# EAGLE board system-controller (EAGLE 7.6.0)
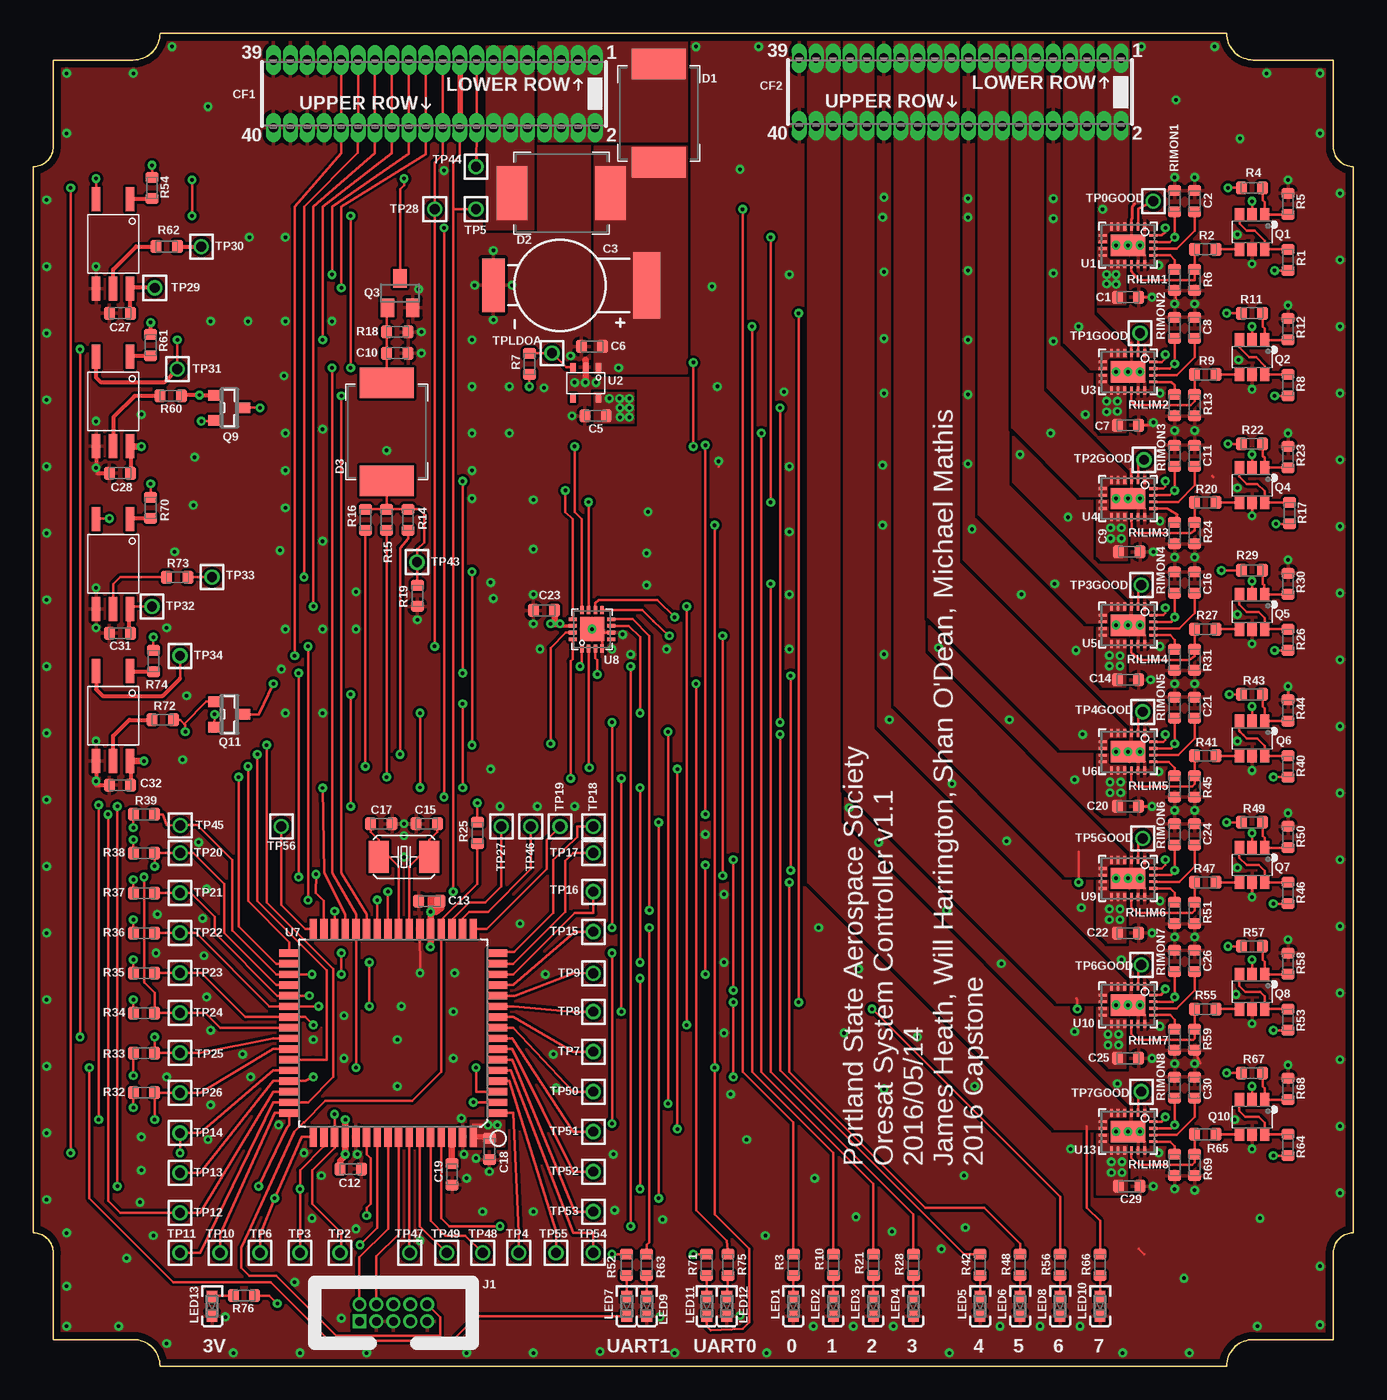
[diagram p2: board, top side]
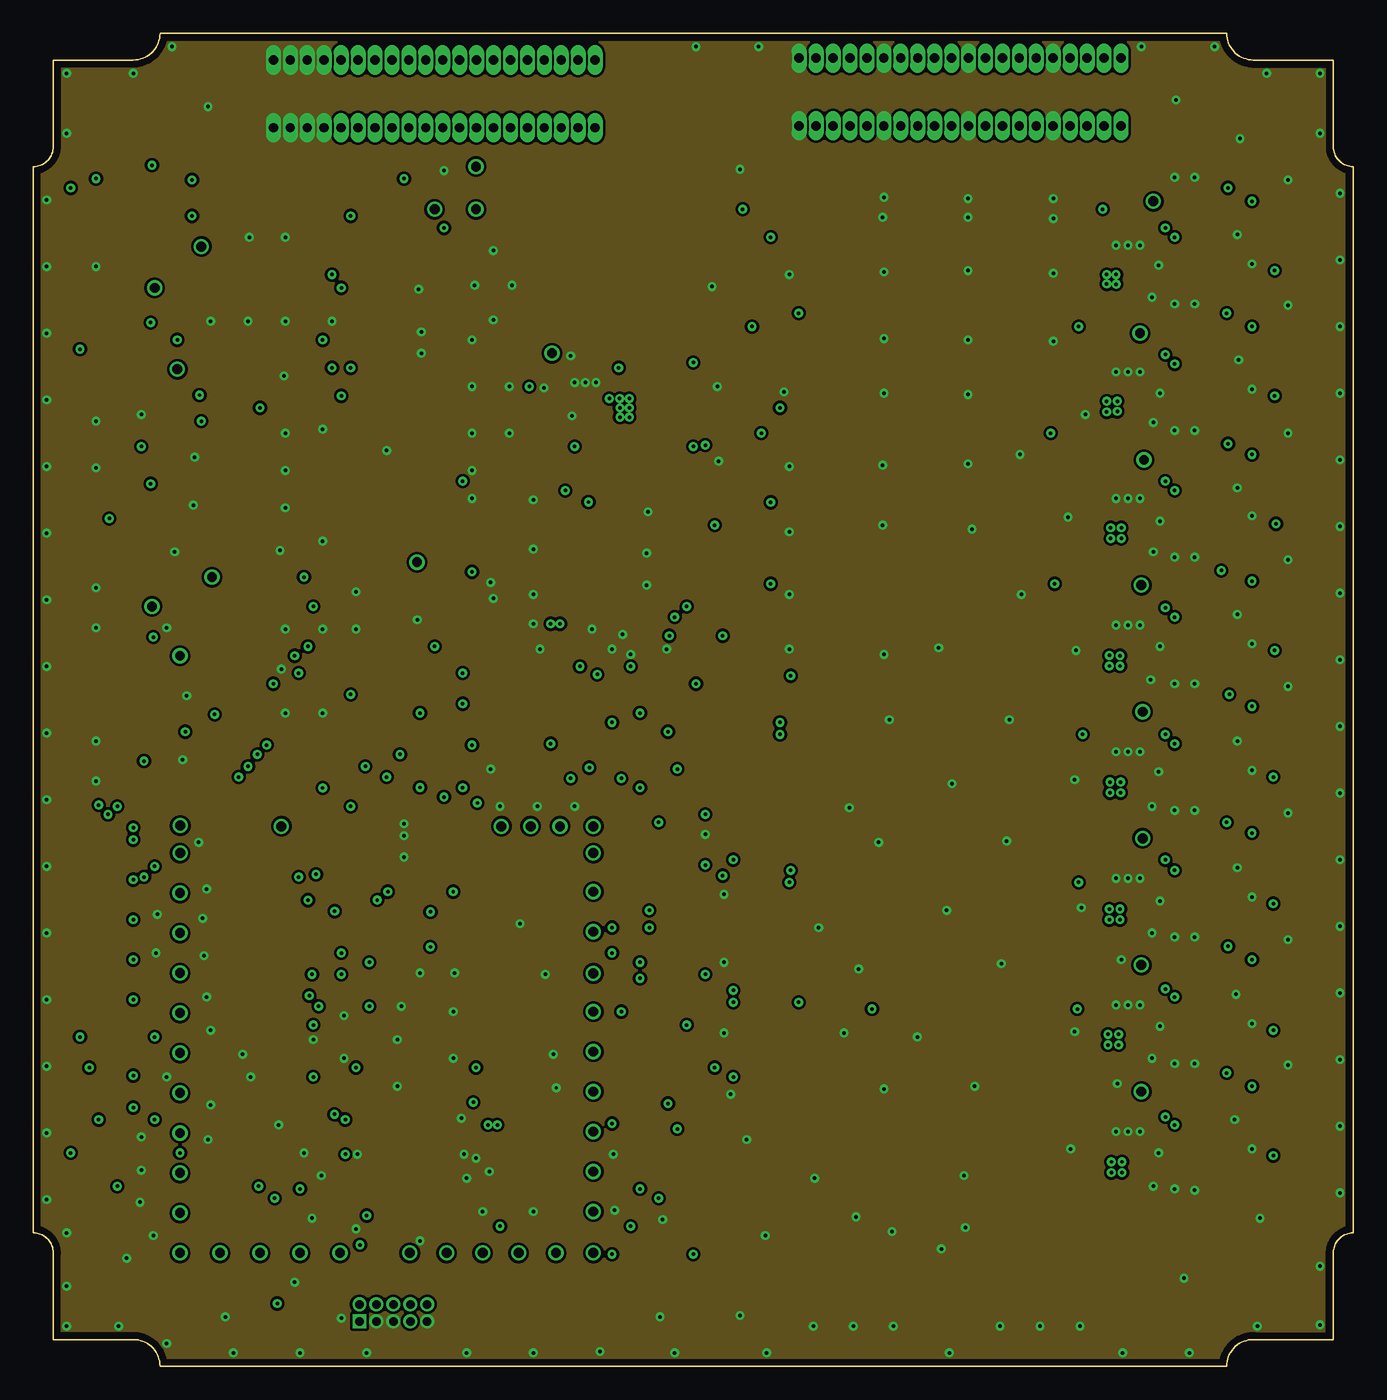
[diagram p3: board, inner layer Route2]
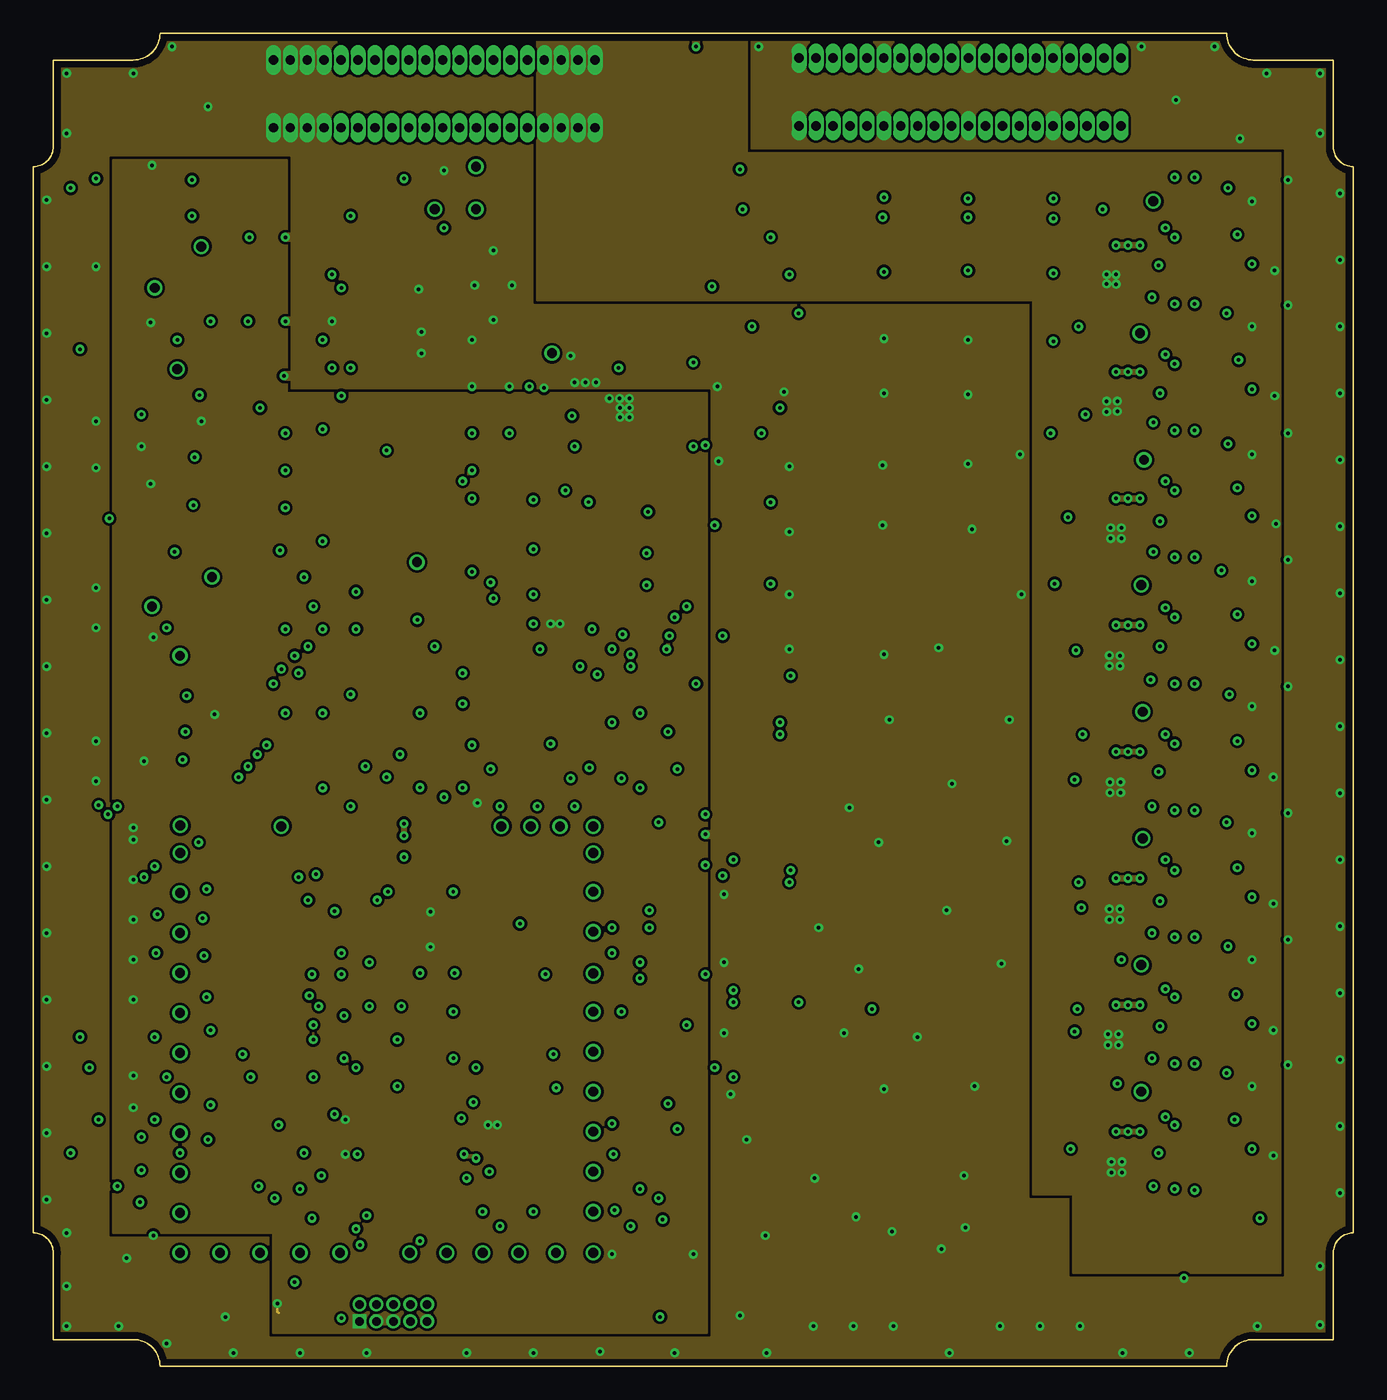
[diagram p4: board, inner layer Route15]
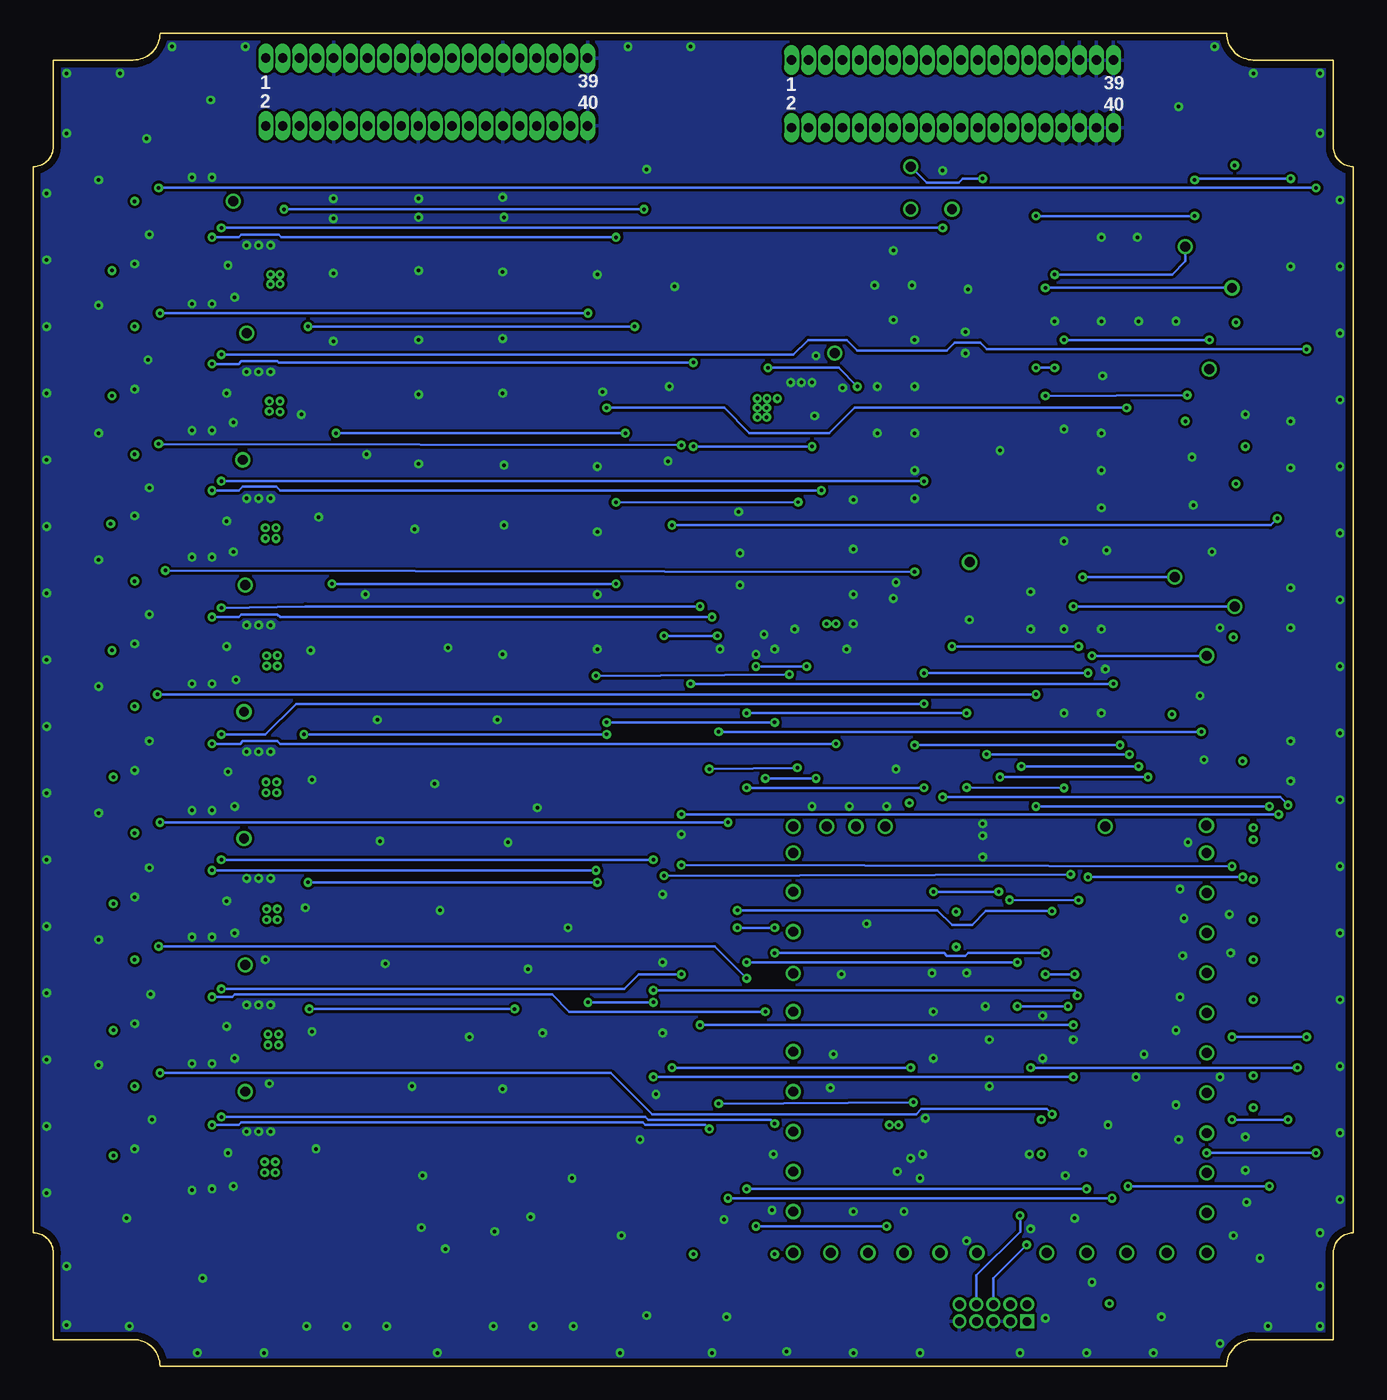
[diagram p5: board, bottom side, seen from below]

Size 99 x 100 mm. Coordinates in mm from the lower left corner, seen from the top.
Copper layers (1+2*15+16): Top 0.0178mm / dielectric 12mil / Route2 0.0356mm / dielectric 28mil / Route15 0.0356mm / dielectric 12mil / Bottom 0.0178mm
Design rules "psas-4Lyr_v1.0.0.3": minimum track width 6mil, minimum drill 10mil, track to track 6mil, track to pad 6mil, pad to pad 6mil, via to via 6mil, smd to smd 6mil, copper to edge 20mil, drill to drill 16mil, minimum pad ring 8mil, minimum via ring 8mil, stop-mask expansion 3mil, vias tented up to drill 11mil, thermal gap 10mil
tRestrict: 8 lines

## Footprints (pad centres in the part's own frame; a part is rotated, then mirrored left to right if it is on the bottom)
.0603-B-NOSILK = smd 0.8 x 0.95: 1 -0.8,0; 2 0.8,0
CAP-ELNA-DS-SERIES = smd 5 x 2: + 0,6.5 | smd 4 x 1.7: - 0,-5
HARWIN-ARCHER-M50-3202045 = drill 0.7 pad 1.07 long: P$1 -12.065,-2.54; P$2 -12.065,2.54; P$3 -10.795,-2.54; P$4 -10.795,2.54; P$5 -9.525,-2.54; P$6 -9.525,2.54; P$7 -8.255,-2.54; P$8 -8.255,2.54; P$9 -6.985,-2.54; P$10 -6.985,2.54; P$11 -5.715,-2.54; P$12 -5.715,2.54; P$13 -4.445,-2.54; P$14 -4.445,2.54; P$15 -3.175,-2.54; P$16 -3.175,2.54; P$17 -1.905,-2.54; P$18 -1.905,2.54; P$19 -0.635,-2.54; P$20 -0.635,2.54; P$21 0.635,-2.54; P$22 0.635,2.54; P$23 1.905,-2.54; P$24 1.905,2.54; P$25 3.175,-2.54; P$26 3.175,2.54; P$27 4.445,-2.54; P$28 4.445,2.54; P$29 5.715,-2.54; P$30 5.715,2.54; P$31 6.985,-2.54; P$32 6.985,2.54; P$33 8.255,-2.54; P$34 8.255,2.54; P$35 9.525,-2.54; P$36 9.525,2.54; P$37 10.795,-2.54; P$38 10.795,2.54; P$39 12.065,-2.54; P$40 12.065,2.54
DO-214AB = smd 2.286 x 4.064: 1 -3.683,0; 2 3.683,0
PINHEADER-2X5-0.05+POL+SILK = drill 0.635 pad 1.04 square: 1 -2.54,-0.635 | drill 0.635 pad 1.04: 2 -2.54,0.635; 3 -1.27,-0.635; 4 -1.27,0.635; 5 0,-0.635; 6 0,0.635; 7 1.27,-0.635; 8 1.27,0.635; 9 2.54,-0.635; 10 2.54,0.635
LED-0603 = smd 0.8 x 0.8: A 0.75,0; K -0.75,0
SOT23-6 = smd 0.7 x 1: 1 0.95,1.3; 2 0,1.3; 3 -0.95,1.3; 4 -0.95,-1.3; 5 0,-1.3; 6 0.95,-1.3
SOT23 = smd 1 x 1.4: 1 -0.95,-1.1; 2 0.95,-1.1; 3 0,1.1
SOT23' = smd 0.787 x 0.889: 1 -0.953,-1.143; 2 0.953,-1.143; 3 0,1.143
2MM-TEST-POINT = drill 0.737: 1 0,0
QFN-20-L = smd 0.2 x 0.6: 1 -1.252,-1.395; 2 -0.752,-1.395; 3 -0.252,-1.395; 4 0.248,-1.395; 5 0.748,-1.395; 6 1.248,-1.395; 11 1.248,1.405; 12 0.748,1.405; 13 0.248,1.405; 14 -0.252,1.405; 15 -0.752,1.405; 16 -1.252,1.405 | smd 0.6 x 0.2: 7 1.905,-0.748; 8 1.905,-0.248; 9 1.905,0.252; 10 1.905,0.752; 17 -1.908,0.755; 18 -1.91,0.25; 19 -1.905,-0.248; 20 -1.905,-0.748 | smd 2.6 x 1.6: 21 0,0
SOT-23 = smd 0.4 x 0.625: 1 0.978,1.142; 2 0.028,1.142; 3 -0.922,1.142; 4 -0.922,-1.188; 5 0.978,-1.188
TQFP64 = smd 1.5 x 0.55: 1 -7.8,6; 2 -7.8,5.2; 3 -7.8,4.4; 4 -7.8,3.6; 5 -7.8,2.8; 6 -7.8,2; 7 -7.8,1.2; 8 -7.8,0.4; 9 -7.8,-0.4; 10 -7.8,-1.2; 11 -7.8,-2; 12 -7.8,-2.8; 13 -7.8,-3.6; 14 -7.8,-4.4; 15 -7.8,-5.2; 16 -7.8,-6; 33 7.8,-6; 34 7.8,-5.2; 35 7.8,-4.4; 36 7.8,-3.6; 37 7.8,-2.8; 38 7.8,-2; 39 7.8,-1.2; 40 7.8,-0.4; 41 7.8,0.4; 42 7.8,1.2; 43 7.8,2; 44 7.8,2.8; 45 7.8,3.6; 46 7.8,4.4; 47 7.8,5.2; 48 7.8,6 | smd 0.55 x 1.5: 17 -6,-7.8; 18 -5.2,-7.8; 19 -4.4,-7.8; 20 -3.6,-7.8; 21 -2.8,-7.8; 22 -2,-7.8; 23 -1.2,-7.8; 24 -0.4,-7.8; 25 0.4,-7.8; 26 1.2,-7.8; 27 2,-7.8; 28 2.8,-7.8; 29 3.6,-7.8; 30 4.4,-7.8; 31 5.2,-7.8; 32 6,-7.8; 49 6,7.8; 50 5.2,7.8; 51 4.4,7.8; 52 3.6,7.8; 53 2.8,7.8; 54 2,7.8; 55 1.2,7.8; 56 0.4,7.8; 57 -0.4,7.8; 58 -1.2,7.8; 59 -2,7.8; 60 -2.8,7.8; 61 -3.6,7.8; 62 -4.4,7.8; 63 -5.2,7.8; 64 -6,7.8
QFN50P400X400X80-17N = smd 0.6 x 0.28: 1 -1.444,0.752; 2 -1.444,0.254; 3 -1.444,-0.254; 4 -1.444,-0.752; 9 1.456,-0.752; 10 1.456,-0.254; 11 1.456,0.254; 12 1.456,0.752 | smd 0.28 x 0.6: 5 -0.752,-1.444; 6 -0.254,-1.444; 7 0.254,-1.444; 8 0.752,-1.444; 13 0.752,1.456; 14 0.254,1.456; 15 -0.254,1.456; 16 -0.752,1.456 | smd 1.8 x 1.8: 17 0,0
ACPL-M61L = smd 0.64 x 1.8: 1 -1.255,-3.655; 2 1.285,-3.655; 3 1.285,3.075; 4 0.015,3.075; 5 -1.255,3.075
CRYSTAL-ABRACON-ABM3-SMD = smd 1.5 x 2.4: P$1 -1.9,0; P$2 1.9,0

## Placement (x,y rotation side)
C1  1uF  [.0603-B-NOSILK]  82.1,80.2 180 top
C2  2.2nF  [.0603-B-NOSILK]  87.1,87.4 90 top
C3  CAP-ELNA-DS  [CAP-ELNA-DS-SERIES]  39.5,81.1 270 top
C5  2.2uF  [.0603-B-NOSILK]  42.17,71.3 180 top
C6  1uF  [.0603-B-NOSILK]  41.9,76.5 0 top
C7  1uF  [.0603-B-NOSILK]  82.1,70.6 180 top
C8  2.2nF  [.0603-B-NOSILK]  87.1,77.9 90 top
C9  1uF  [.0603-B-NOSILK]  82.2,61.1 180 top
C10  22u  [.0603-B-NOSILK]  27.3,76 0 top
C11  2.2nF  [.0603-B-NOSILK]  87.1,68.3 90 top
C12  100nF  [.0603-B-NOSILK]  23.8,14.8 180 top
C13  100nF  [.0603-B-NOSILK]  29.7,34.9 0 top
C14  1uF  [.0603-B-NOSILK]  82.1,51.5 180 top
C15  9pF  [.0603-B-NOSILK]  29.5,40.7 0 top
C16  2.2nF  [.0603-B-NOSILK]  87.1,58.8 90 top
C17  9pF  [.0603-B-NOSILK]  26.1,40.7 180 top
C18  100nF  [.0603-B-NOSILK]  34.2,16.3 90 top
C19  100nF  [.0603-B-NOSILK]  31.4,14.4 90 top
C20  1uF  [.0603-B-NOSILK]  82.1,42 180 top
C21  2.2nF  [.0603-B-NOSILK]  87.1,49.4 90 top
C22  1uF  [.0603-B-NOSILK]  82.1,32.5 180 top
C23  1uF  [.0603-B-NOSILK]  38.3,56.7 0 top
C24  2.2nF  [.0603-B-NOSILK]  87.1,39.9 90 top
C25  1uF  [.0603-B-NOSILK]  82.1,23.1 180 top
C26  2.2nF  [.0603-B-NOSILK]  87.1,30.4 90 top
C27  100nF  [.0603-B-NOSILK]  6.5,79 0 top
C28  100nF  [.0603-B-NOSILK]  6.5,67 0 top
C29  1uF  [.0603-B-NOSILK]  82.2,13.5 180 top
C30  2.2nF  [.0603-B-NOSILK]  87.1,20.9 90 top
C31  100nF  [.0603-B-NOSILK]  6.5,55 0 top
C32  100nF  [.0603-B-NOSILK]  6.5,43.6 0 top
CF1  ORESAT-CONNECTOR-40PIN  [HARWIN-ARCHER-M50-3202045]  30.07,95.46 180 top
CF2  ORESAT-CONNECTOR-40PIN  [HARWIN-ARCHER-M50-3202045]  69.5,95.6 180 top
D1  SSC53L  [DO-214AB]  46.9,94 270 top
D2  SSC53L  [DO-214AB]  39.6,88 0 top
D3  SMD-DIODE-SCHOTTKY-40V-5A(DO-214AB)-SSC53L  [DO-214AB]  26.5,70.1 90 top
J1  1  [PINHEADER-2X5-0.05+POL+SILK]  27,4 0 top
LED1  DNP/GRN  [LED-0603]  57,4.5 90 top
LED2  DNP/GRN  [LED-0603]  60,4.5 90 top
LED3  DNP/GRN  [LED-0603]  63,4.5 90 top
LED4  DNP/GRN  [LED-0603]  66,4.5 90 top
LED5  DNP/GRN  [LED-0603]  71,4.5 90 top
LED6  DNP/GRN  [LED-0603]  74,4.5 90 top
LED7  DNP/AMB  [LED-0603]  44.5,4.5 90 top
LED8  DNP/GRN  [LED-0603]  77,4.5 90 top
LED9  DNP/AMB  [LED-0603]  46,4.5 90 top
LED10  DNP/GRN  [LED-0603]  80,4.5 90 top
LED11  DNP/AMB  [LED-0603]  50.5,4.5 90 top
LED12  DNP/AMB  [LED-0603]  52,4.5 90 top
LED13  DNP/GRN  [LED-0603]  13.4,4.5 90 top
Q1  MOSFET-P-N-PAIR  [SOT23-6]  91.4,85.1 0 top
Q2  MOSFET-P-N-PAIR  [SOT23-6]  91.4,75.7 0 top
Q3  DON3035L  [SOT23]  27.5,80.5 0 top
Q4  MOSFET-P-N-PAIR  [SOT23-6]  91.4,66.1 0 top
Q5  MOSFET-P-N-PAIR  [SOT23-6]  91.4,56.6 0 top
Q6  MOSFET-P-N-PAIR  [SOT23-6]  91.4,47.1 0 top
Q7  MOSFET-P-N-PAIR  [SOT23-6]  91.4,37.6 0 top
Q8  MOSFET-P-N-PAIR  [SOT23-6]  91.4,28.1 0 top
Q9  DNP/NTR4101P  [SOT23']  14.7,71.9 270 top
Q10  MOSFET-P-N-PAIR  [SOT23-6]  91.4,18.7 0 top
Q11  DNP/NTR4101P  [SOT23']  14.7,48.9 270 top
R1  47k  [.0603-B-NOSILK]  94.1,83 90 top
R2  93.1k  [.0603-B-NOSILK]  87.9,83.8 180 top
R3  DNP/1k  [.0603-B-NOSILK]  57,7.6 270 top
R4  4.7k  [.0603-B-NOSILK]  91.4,88.4 0 top
R5  47k  [.0603-B-NOSILK]  94.1,87.2 90 top
R6  47k  [.0603-B-NOSILK]  87.1,81.5 270 top
R7  10k  [.0603-B-NOSILK]  37.2,75.2 90 top
R8  47k  [.0603-B-NOSILK]  94.1,73.6 90 top
R9  93.1k  [.0603-B-NOSILK]  87.9,74.4 180 top
R10  DNP/1k  [.0603-B-NOSILK]  60,7.6 270 top
R11  4.7k  [.0603-B-NOSILK]  91.4,79 0 top
R12  47k  [.0603-B-NOSILK]  94.1,77.8 90 top
R13  47k  [.0603-B-NOSILK]  87.1,72.1 270 top
R14  390  [.0603-B-NOSILK]  28.1,63.5 270 top
R15  390  [.0603-B-NOSILK]  26.5,63.5 270 top
R16  390  [.0603-B-NOSILK]  24.9,63.5 270 top
R17  47k  [.0603-B-NOSILK]  94.2,64 90 top
R18  470k  [.0603-B-NOSILK]  27.3,77.6 0 top
R19  390  [.0603-B-NOSILK]  28.8,57.8 270 top
R20  93.1k  [.0603-B-NOSILK]  87.9,64.8 180 top
R21  DNP/1k  [.0603-B-NOSILK]  63,7.6 270 top
R22  4.7k  [.0603-B-NOSILK]  91.4,69.2 0 top
R23  47k  [.0603-B-NOSILK]  94.1,68.2 90 top
R24  47k  [.0603-B-NOSILK]  87.1,62.5 270 top
R25  390  [.0603-B-NOSILK]  33.3,40 270 top
R26  47k  [.0603-B-NOSILK]  94.1,54.5 90 top
R27  93.1k  [.0603-B-NOSILK]  87.9,55.3 180 top
R28  DNP/1k  [.0603-B-NOSILK]  66,7.6 270 top
R29  4.7k  [.0603-B-NOSILK]  91.4,59.7 0 top
R30  47k  [.0603-B-NOSILK]  94.1,58.7 90 top
R31  47k  [.0603-B-NOSILK]  87.1,53 270 top
R32  47k  [.0603-B-NOSILK]  8.3,20.53 0 top
R33  47k  [.0603-B-NOSILK]  8.3,23.5 0 top
R34  47k  [.0603-B-NOSILK]  8.3,26.5 0 top
R35  47k  [.0603-B-NOSILK]  8.3,29.5 0 top
R36  47k  [.0603-B-NOSILK]  8.3,32.5 0 top
R37  47k  [.0603-B-NOSILK]  8.3,35.5 0 top
R38  47k  [.0603-B-NOSILK]  8.3,38.5 0 top
R39  47k  [.0603-B-NOSILK]  8.3,41.4 0 top
R40  47k  [.0603-B-NOSILK]  94.1,45 90 top
R41  93.1k  [.0603-B-NOSILK]  87.9,45.8 180 top
R42  DNP/1k  [.0603-B-NOSILK]  71,7.6 270 top
R43  4.7k  [.0603-B-NOSILK]  91.4,50.4 0 top
R44  47k  [.0603-B-NOSILK]  94.1,49.2 90 top
R45  47k  [.0603-B-NOSILK]  87.1,43.5 270 top
R46  47k  [.0603-B-NOSILK]  94.1,35.5 90 top
R47  93.1k  [.0603-B-NOSILK]  87.9,36.3 180 top
R48  DNP/1k  [.0603-B-NOSILK]  74,7.6 270 top
R49  4.7k  [.0603-B-NOSILK]  91.4,40.8 0 top
R50  47k  [.0603-B-NOSILK]  94.1,39.7 90 top
R51  47k  [.0603-B-NOSILK]  87.1,34 270 top
R52  DNP/1k  [.0603-B-NOSILK]  44.5,7.6 270 top
R53  47k  [.0603-B-NOSILK]  94.1,26 90 top
R54  390  [.0603-B-NOSILK]  8.9,88.4 90 top
R55  93.1k  [.0603-B-NOSILK]  87.9,26.8 180 top
R56  DNP/1k  [.0603-B-NOSILK]  77,7.6 270 top
R57  4.7k  [.0603-B-NOSILK]  91.4,31.5 0 top
R58  47k  [.0603-B-NOSILK]  94.1,30.2 90 top
R59  47k  [.0603-B-NOSILK]  87.1,24.5 270 top
R60  0 Ohm  [.0603-B-NOSILK]  10.3,72.8 180 top
R61  390  [.0603-B-NOSILK]  8.8,76.6 90 top
R62  1k  [.0603-B-NOSILK]  10,84 180 top
R63  DNP/1k  [.0603-B-NOSILK]  46,7.6 270 top
R64  47k  [.0603-B-NOSILK]  94.1,16.6 90 top
R65  93.1k  [.0603-B-NOSILK]  87.9,17.4 180 top
R66  DNP/1k  [.0603-B-NOSILK]  80,7.6 270 top
R67  4.7k  [.0603-B-NOSILK]  91.4,22 0 top
R68  47k  [.0603-B-NOSILK]  94.1,20.8 90 top
R69  47k  [.0603-B-NOSILK]  87.1,15.1 270 top
R70  390  [.0603-B-NOSILK]  8.8,64.4 90 top
R71  DNP/1k  [.0603-B-NOSILK]  50.5,7.6 270 top
R72  0 Ohm  [.0603-B-NOSILK]  9.7,48.5 0 top
R73  1k  [.0603-B-NOSILK]  10.8,59.2 180 top
R74  390  [.0603-B-NOSILK]  9,52.9 90 top
R75  DNP/1k  [.0603-B-NOSILK]  52.1,7.6 270 top
R76  DNP/1k  [.0603-B-NOSILK]  15.8,5.3 180 top
RILIM1  47k  [.0603-B-NOSILK]  85.6,81.5 270 top
RILIM2  47k  [.0603-B-NOSILK]  85.6,72.1 270 top
RILIM3  47k  [.0603-B-NOSILK]  85.6,62.5 270 top
RILIM4  47k  [.0603-B-NOSILK]  85.6,53 270 top
RILIM5  47k  [.0603-B-NOSILK]  85.6,43.5 270 top
RILIM6  47k  [.0603-B-NOSILK]  85.6,34 270 top
RILIM7  47k  [.0603-B-NOSILK]  85.6,24.5 270 top
RILIM8  47k  [.0603-B-NOSILK]  85.6,15.1 270 top
RIMON1  30k  [.0603-B-NOSILK]  85.6,87.4 90 top
RIMON2  30k  [.0603-B-NOSILK]  85.6,77.9 90 top
RIMON3  30k  [.0603-B-NOSILK]  85.6,68.3 90 top
RIMON4  30k  [.0603-B-NOSILK]  85.6,58.8 90 top
RIMON5  30k  [.0603-B-NOSILK]  85.6,49.4 90 top
RIMON6  30k  [.0603-B-NOSILK]  85.6,39.9 90 top
RIMON7  30k  [.0603-B-NOSILK]  85.6,30.4 90 top
RIMON8  30k  [.0603-B-NOSILK]  85.6,20.9 90 top
TP0GOOD  TEST-POINT  [2MM-TEST-POINT]  84,87.4 180 top
TP1GOOD  TEST-POINT  [2MM-TEST-POINT]  83,77.5 0 top
TP2  TEST-POINT  [2MM-TEST-POINT]  23,8.5 180 top
TP2GOOD  TEST-POINT  [2MM-TEST-POINT]  83.3,68 180 top
TP3  TEST-POINT  [2MM-TEST-POINT]  20,8.5 180 top
TP3GOOD  TEST-POINT  [2MM-TEST-POINT]  83.1,58.6 180 top
TP4  TEST-POINT  [2MM-TEST-POINT]  36.4,8.5 0 top
TP4GOOD  TEST-POINT  [2MM-TEST-POINT]  83.2,49.1 0 top
TP5  TEST-POINT  [2MM-TEST-POINT]  33.2,86.8 0 top
TP5GOOD  TEST-POINT  [2MM-TEST-POINT]  83.2,39.6 180 top
TP6  TEST-POINT  [2MM-TEST-POINT]  17,8.5 0 top
TP6GOOD  TEST-POINT  [2MM-TEST-POINT]  83.1,30.1 180 top
TP7  TEST-POINT  [2MM-TEST-POINT]  42,23.6 0 top
TP7GOOD  TEST-POINT  [2MM-TEST-POINT]  83.1,20.6 180 top
TP8  TEST-POINT  [2MM-TEST-POINT]  42,26.6 0 top
TP9  TEST-POINT  [2MM-TEST-POINT]  42,29.47 0 top
TP10  TEST-POINT  [2MM-TEST-POINT]  14,8.5 180 top
TP11  TEST-POINT  [2MM-TEST-POINT]  11,8.5 180 top
TP12  TEST-POINT  [2MM-TEST-POINT]  11,11.5 180 top
TP13  TEST-POINT  [2MM-TEST-POINT]  11,14.5 0 top
TP14  TEST-POINT  [2MM-TEST-POINT]  11,17.49 0 top
TP15  TEST-POINT  [2MM-TEST-POINT]  42,32.6 0 top
TP16  TEST-POINT  [2MM-TEST-POINT]  42,35.6 0 top
TP17  TEST-POINT  [2MM-TEST-POINT]  42,38.5 180 top
TP18  TEST-POINT  [2MM-TEST-POINT]  42,40.5 180 top
TP19  TEST-POINT  [2MM-TEST-POINT]  39.5,40.5 0 top
TP20  TEST-POINT  [2MM-TEST-POINT]  11.01,38.5 0 top
TP21  TEST-POINT  [2MM-TEST-POINT]  11,35.5 0 top
TP22  TEST-POINT  [2MM-TEST-POINT]  11,32.5 0 top
TP23  TEST-POINT  [2MM-TEST-POINT]  11,29.5 0 top
TP24  TEST-POINT  [2MM-TEST-POINT]  11,26.5 0 top
TP25  TEST-POINT  [2MM-TEST-POINT]  11,23.5 0 top
TP26  TEST-POINT  [2MM-TEST-POINT]  11,20.5 0 top
TP27  TEST-POINT  [2MM-TEST-POINT]  35.1,40.5 180 top
TP28  TEST-POINT  [2MM-TEST-POINT]  30.1,86.8 0 top
TP29  TEST-POINT  [2MM-TEST-POINT]  9.1,80.9 0 top
TP30  TEST-POINT  [2MM-TEST-POINT]  12.6,84 0 top
TP31  TEST-POINT  [2MM-TEST-POINT]  10.8,74.8 0 top
TP32  TEST-POINT  [2MM-TEST-POINT]  8.9,57 0 top
TP33  TEST-POINT  [2MM-TEST-POINT]  13.4,59.2 0 top
TP34  TEST-POINT  [2MM-TEST-POINT]  11,53.3 0 top
TP43  TEST-POINT  [2MM-TEST-POINT]  28.78,60.32 0 top
TP44  TEST-POINT  [2MM-TEST-POINT]  33.2,90 0 top
TP45  TEST-POINT  [2MM-TEST-POINT]  11.02,40.56 0 top
TP46  TEST-POINT  [2MM-TEST-POINT]  37.3,40.5 180 top
TP47  TEST-POINT  [2MM-TEST-POINT]  28.23,8.5 180 top
TP48  TEST-POINT  [2MM-TEST-POINT]  33.7,8.5 180 top
TP49  TEST-POINT  [2MM-TEST-POINT]  31,8.5 180 top
TP50  TEST-POINT  [2MM-TEST-POINT]  42,20.6 0 top
TP51  TEST-POINT  [2MM-TEST-POINT]  42,17.6 0 top
TP52  TEST-POINT  [2MM-TEST-POINT]  42,14.6 0 top
TP53  TEST-POINT  [2MM-TEST-POINT]  42,11.6 0 top
TP54  TEST-POINT  [2MM-TEST-POINT]  42,8.5 0 top
TP55  TEST-POINT  [2MM-TEST-POINT]  39.2,8.5 180 top
TP56  TEST-POINT  [2MM-TEST-POINT]  18.6,40.5 180 top
TPLDOA  TEST-POINT  [2MM-TEST-POINT]  38.9,76 180 top
U1  TPS25944LRVCRWQFN-20-3X4  [QFN-20-L]  82.1,84.1 180 top
U2  LP5907MFX-3.0  [SOT-23]  41.4,73.8 0 top
U3  TPS25944LRVCRWQFN-20-3X4  [QFN-20-L]  82.1,74.6 180 top
U4  TPS25944LRVCRWQFN-20-3X4  [QFN-20-L]  82.1,65.1 180 top
U5  TPS25944LRVCRWQFN-20-3X4  [QFN-20-L]  82.1,55.6 180 top
U6  TPS25944LRVCRWQFN-20-3X4  [QFN-20-L]  82.1,46.1 180 top
U7  ATMEGA128L-8A(U/N)  [TQFP64]  26.99,24.99 180 top
U8  TS4100  [QFN50P400X400X80-17N]  41.9,55.29 90 top
U9  TPS25944LRVCRWQFN-20-3X4  [QFN-20-L]  82.1,36.6 180 top
U10  TPS25944LRVCRWQFN-20-3X4  [QFN-20-L]  82.1,27.1 180 top
U13  TPS25944LRVCRWQFN-20-3X4  [QFN-20-L]  82.1,17.6 180 top
U$1  ACPL-M61L  [ACPL-M61L]  6,83.9 180 top
U$2  ACPL-M61L  [ACPL-M61L]  6,59.9 180 top
U$3  ACPL-M61L  [ACPL-M61L]  6,72.1 180 top
U$4  ACPL-M61L  [ACPL-M61L]  6,48.5 180 top
U$5  [ORESAT-CARD-V0.3]  0,0 0 top
X1  8 MHz CRYSTAL-ABRACON-ABM3-SMD  [CRYSTAL-ABRACON-ABM3-SMD]  27.8,38.21 180 top

## Tracks (layer width: path | path; a pad name or v marks a point on that pad's centre or on a via)
3V  (via drill 0.25)
  Top 0.2: Q9.2 13.5,70.9 v12.6,70.9 | v33.3,42.26 R25.1 | R33.1 v7.5,21.8 | R34.1 v7.5,27.5 | R35.1 v7.5,30.5 | R36.1 v7.5,33.5 | R37.1 v7.5,36.5 | R39.1 v7.5,40.4 | R32.1 v7.5,19.4 | R38.1 v7.5,39.5 | U7.64 33,18.1 v34.8,18.1 | Q11.2 v13.6,48.9 | R54.2 v8.9,90.1 | R70.2 v8.8,66.2 | R74.2 v9,54.7 | R71.1 v49.5,8.4 | R52.1 v43.4,8.4 | 7.3,45.3 | R76.1 17.7,5.3 v18.3,4.7
  Top 0.25: v39.5,55.7 39.76,55.54 U8.14
  Top 0.3: R61.2 v8.8,78.3 | C28.2 7.3,68.9 7.3,69.03 U$3.5 | 7.25,45.4 7.3,45.4 7.3,45.3 C32.2 | 7.2,45.4 7.25,45.4 | 7.25,45.4 U$4.5
  Top 0.4: U7.64 34.51,17.19 C18.2
  Top 0.5: U7.52 v23.4,15.9 23.4,15.8 23,15.4 C12.2 | U7.52 | v23.4,18.5 U7.52 | 29.8,31.6 29.8,31.7 29.79,31.7 U7.21 v29.79,34.09 | 7.25,43.65 C32.2 | v8.3,45.4 7.2,45.4 | 7.25,67.05 C28.2 | v8.1,69 7.4,69 7.3,68.9 | v39.5,55.7 39.1,55.7 | 39.1,55.7 v38.8,55.7 | C23.2 39.1,55.7 | v29.79,34.09 29.79,34.8 C13.2 | v29.79,34.09 30.3,34.6 | v29.79,34.09 30.19,34.09 30.6,34.4 | v29.79,34.09 29.79,35.1 30.6,35.1
  Route15 0.2: v18.3,4.7 18.3,4.1 18.4,4
  other vias: 43.97,72.6 43.2,72.6 34.1,18.1 29.78,31.46 44.7,72.6 44,71.2 44.7,71.2 44.7,71.9 44,71.9
  pour Route15 (isolate 0.2, no thermals): 6,90.5 6,10 18,10 18,2.5 50.5,2.5 50.5,73 19,73 19,90.5
  pour Top (isolate 0.2, no thermals): 32.8,16.5 35.3,16.5 35.3,18.4 32.8,18.4
  pour Top (isolate 0.2, no thermals): 42.1,73 45,73 45,70.8 42.1,70.8
AREF
  Top 0.4: 31.39,15.31 C19.2
  Top 0.5: U7.62 31.39,15.31
GND  (via drill 0.25)
  Top 0.2: 51.4,67.5 v51.4,67.9 | U7.22 v29,29.5 | U3.21 82.35,74.85 82.35,75.1 83,75.1 | C1.1 v83.9,80.2 | RILIM1.2 85.8,79.5 | C7.1 83.8,70.6 v84,70.8 | 82.35,55.85 U5.21 82.4,55.9 82.9,55.9 | C20.1 83.7,42 | U10.21 82.35,27.35 82.35,27.6 82.45,27.7 83.2,27.7 | Q7.5 v91.4,35.2 | R44.2 v94.1,51 | 88.4,66.8 88.5,66.7 | Q4.5 v91.4,63.8 | 82.9,8.8 83.3,8.4 | R59.2 87.51,22.71 | U8.6 42.15,55.04 U8.17 | U8.4 42.65,54.6 42.4,54.6 | 82.25,17.85 82.35,17.95 82.35,17.85 U13.21 | U4.3 82.35,67.25 82.3,67.3 | U3.3 82.35,76.75 82.3,76.8 | U1.3 82.35,86.05 82.4,86.1 82.4,87 82.6,87.2
  Top 0.3: U$3.3 v4.7,67.4 4.8,67.4 4.8,67 C28.1 | 4.7,45.4 v4.7,43.9 4.7,43.6 C32.1
  Top 0.5: 41.4,75.5 41.43,75.47 U2.2 41.43,73.83 v41.4,73.8
  other vias: 84.5,73 87.1,70.2 91.4,73.3 85.6,79.7 84.4,82.6 91.4,82.7 85.6,70.2 90.3,65.9 94.1,70 87.1,60.7 85.6,60.7 94.1,60.5 87.1,51.2 84.5,54 91.4,54.2 84.4,44.6 87.1,41.7 83.9,42 85.6,51.2 83.8,51.5 84,61.1 94.1,41.5 87.1,32.2 85.6,32.2 84.5,34.9 83.9,32.5 90.2,27.9 91.4,25.7 84.5,25.5 85.6,22.7 87.1,22.7 94.1,22.6 91.4,16.3 87.1,13.2 85.6,13.3 84.4,16 12.4,39.3 13,35.8 9.3,33.9 12.7,33.6 9.2,31 12.8,30.8 13.1,17 27.3,24.5 31.5,23.1 31.6,29.5 36.5,33.2 38.4,29.4 39,23.4 39.22,20.88 82.1,74.6 44.8,53.4 33.7,11.6 32.5,14.1 21.6,14.3 23.1,3.6 13,27.7 47.5,53.8 38,53.8 90.3,56.4 91.4,44.7 50.4,39.9 81.2,74.6 83,74.6 81.2,17.6 82.1,17.6 82.1,27.1 83,27.1 82.1,36.6 83,36.6 83,46.1 82.1,46.1 81.2,55.6 83,55.6 83,65.1 81.2,65.1 30.8,89.7 22.4,78.4 21.7,70.3 21.7,61.9 21.7,55.3 21.7,49 18.9,49 13.3,25.2 13.3,19.6 15.7,23.4 16.3,21.7 8.1,17.2 8.1,14.7 8,12.3 9,9.8 15,1 14.4,3.7 19.6,6.3 37.5,11.6 47.2,11 58.5,3 61.5,3 64.5,3 72.5,3 75.5,3 7.5,97 2.5,97 10.4,99 2.5,92.5 16.2,84.7 11.2,45.5 23.3,23.1 27.3,21 31.5,26.6 21,24.5 29.1,77.6 29.1,76 54.4,99 87.1,89.2 83.1,99 88.6,99 49.7,99 94.1,89 78.5,3 82.1,84.1 81.2,84.1 84.5,63.4 32.9,77 32.9,73.5 35.7,73.5 32.9,70 35.7,70 32.9,67.2 40.4,71.3 38.3,73.4 32.9,65.1 37.5,65 46.1,64.1 18.9,64.4 18.9,67.2 18.9,70 8.1,71.4 12.1,68.2 12,64.6 18.8,74.3 18.9,78.4 16.1,78.4 13.3,78.4 18.9,84.7 18.9,55.3 10,55.4 18.6,52.3 11.5,50.3 24.2,55.3 24.2,58.1 28.8,56 34.3,58.8 34.3,44.8 35,42 37.8,42 40.6,42 4.7,58.4 4.7,82.5 32.3,15.9 34.2,14.6 33.2,15.6 24.3,15.9 27.8,38.2 27.8,40.7 27.8,39.8 4.7,46.9 4.7,55.4 4.7,70.9 42.2,73.8 40.6,73.8 40.3,75.8 34.5,83.7 33.1,81.1 35.9,81.1 34.5,78.5 28.9,80.8 37.5,55.7 37.5,57.9 34.5,57.6 41.9,55.3 44.2,54.9 43.4,53.8 83,84.1 87.1,79.7 85.6,89.2 94.1,79.6 90.3,84.9 90.4,75.5 82.1,65.1 82.1,55.6 81.2,46.1 85.6,41.7 90.3,46.9 81.2,36.6 90.3,37.4 81.2,27.1 83.9,23.1 94.1,32 84,13.5 83,17.6 90.1,18.5 61.2,41.9 63.4,39.3 68.5,34.2 72.6,30.2 78.1,25.1 78.6,34.4 81.6,30.5 81.3,21.2 73,39.4 68.9,43.7 64.2,48.5 63.8,53.4 63.7,63.1 63.7,67.6 63.8,73 63.8,77.1 63.8,82.1 63.8,87.7 70.1,87.6 76.5,87.6 76.5,86.1 70.1,86.2 63.7,86.2 70.1,82.2 76.5,82 76.5,76.9 70.1,77 70.1,72.9 78.9,71.4 70.1,67.7 70.4,62.8 74.1,57.9 78.2,53.7 67.9,53.9 73.2,48.5 78.1,44 58.9,32.9 61.9,29.8 66.3,24.7 70.6,21 77.8,16.3 20.9,11.1 20.3,16 18.4,18.1 2.5,3 2.5,6 2.5,10 1,12.5 1,17.5 1,22.5 1,27.5 1,32.5 1,37.5 1,42.5 1,47.5 1,52.5 1,57.5 1,62.5 1,67.5 1,72.5 1,77.5 1,82.5 1,87.5 98,13 98,18 98,23 98,28 98,33 98,38 98,43 98,48 98,53 98,58 98,63 98,68 98,73 98,78 98,83 98,88 96.5,7.5 96.5,3.1 91.8,3 86.7,1 81.7,1 68.7,1 55,1 48.1,1 37.5,1 42.5,1.1 47,3.7 53,3.8 32.5,1 25,1 20,1 10,1.7 6.4,3 96.5,92.5 96.5,97 92.5,97 74,68.4 77.6,63.7 69.8,14.3 63.8,20.8 60.8,25 51.8,35.4 51.8,30.3 51.8,25 52.3,20.4 53.5,17 58.6,14.1 61.7,11.2 64.4,10.1 68.1,8.8 54.9,9.8 69.9,10.4 43.5,15.9 43.6,11.7 29,9.4 24.2,10.3 7,8.1 23.3,26.3 27.6,27 10,21.7 18.5,61.2 10.6,61.1 46,61 46,58.6 37.5,61.3 50.9,81 51.3,73.5 53,89.8 56.7,81.9 56.7,53.8 56.7,57.9 56.7,62.6 56.7,67.5 56.3,73.1 92,11.1 86.3,6.6 13.1,94.5 90.5,92.1 85.7,95 32.1,18.6 26.5,68.7
  pour Top (isolate 0.2, rank 6): 0,0 0,100 87.3,100 99,100 99,10.6 99,0
  pour Bottom (isolate 0.2, rank 6): 0,0 0,100 99,100 99,0
  pour Route2 (isolate 0.2, rank 6, no thermals): 0,0 0,100 87.3,100 99,100 99,10.6 99,0
  pour Route15 (isolate 0.2, rank 6, no thermals): 0,0 0,100 87.3,100 99,100 99,10.6 99,0
I2C-SCL  (via drill 0.25)
  Top 0.2: U7.25 v26.59,35.6 | 31.5,86.8 31.5,35.5 arc-3 v31.49,35.6 | 31.5,86.8 31.51,90.28 31.97,90.86 CF1.P$18 | TP5.1 31.5,86.8 | 32,97.9 31.9,97.8 31.9,97.93 CF1.P$17
  Top 0.406: 32,97.9 32,92.95 CF1.P$18
  Bottom 0.2: v26.59,35.6 v31.49,35.6
I2C-SDA  (via drill 0.25)
  Top 0.2: CF1.P$19 CF1.P$20 30.7,90.9 30.1,90.3 TP28.1 v30.1,54 | U7.26 v25.79,34.97 | v20.6,34.96 v20.6,54
  Bottom 0.2: v25.79,34.97 v20.6,34.96 | v30.1,54 v20.6,54
INOF
  Top 0.2: U1.18 85.75,83.85 87.1,85.2 C2.1
N$1
  Top 0.2: U7.24 27.39,37.51 26.7,38.2 X1.P$2 25.9,39.5 25.3,40.1 C17.2
N$2
  Top 0.2: Q2.4 R9.1
N$4
  Top 0.2: 7.22,63.48 7.25,63.45 | 7.25,63.45 7.3,63.4 | 7.31,63.6 7.31,63.51 7.25,63.45
  Top 0.3: R70.1 7.31,63.6 | U$2.1 7.31,63.55 7.31,63.51
N$5
  Top 0.3: R62.2 7.7,84 5.99,82.28 U$1.4
N$6
  Top 0.2: R76.2 13.45,5.3 LED13.A
N$8
  Top 0.3: R61.1 7.3,75.8 7.3,75.75 U$3.1
N$9
  Top 0.2: U1.14 82.35,82.15 82.9,81.5 87.1,81.5 R6.1 R2.2
N$10
  Top 0.2: U4.14 82.39,62.91 82.8,62.5 86.8,62.5 87.1,62.7 R24.1 R20.2
N$11
  Top 0.2: J1.4 25.73,8.23 27.4,9.9 U7.57
N$12  (via drill 0.25)
  Top 0.2: v24.5,9.1 25.79,10.39 U7.55
  Bottom 0.2: J1.6 27,6.6 v24.5,9.1
N$13  (via drill 0.25)
  Top 0.2: v25,11.3 25,11.9 25.3,12.2 25.3,15.6 25,15.9 U7.54
  Bottom 0.2: J1.8 28.27,6.83 25,10.1 v25,11.3
N$14
  Top 0.2: J1.2 24.46,8.16 26.6,10.3 U7.56
N$15
  Top 0.2: R25.2 33.3,36.2 30.59,33.49 U7.20 30.59,22.09 28.4,19.9 21.9,19.9 20.3,18.3 20.28,18.3 19.55,17.57 16.1,10 15.6,8.9 15.6,7.4 16.2,6.8 18.2,6.8 22.7,2.3 30.5,2.3 30.5,3.67 J1.10
N$16
  Top 0.2: R73.2 6.5,59.2 6,58.7 6,56.91
  Top 0.3: U$2.4 6,56.91
N$17
  Top 0.2: U7.23 28.19,37.49 28.9,38.2 X1.P$1 29.7,39.5 30.3,40.1 C15.2
N$18
  Top 0.3: R72.1 7.2,48.5 5.99,47.28 U$4.4 5.99,45.4
N$19
  Top 0.2: RILIM3.1 85.8,63.9 85.06,64.34 U4.17
N$21
  Top 0.2: RILIM1.1 85.6,83 85.25,83.34 U1.17
N$22
  Top 0.2: U2.3 39.96,74.94 TPLDOA.1 R7.2
N$24
  Top 0.2: 6,68.94 6.06,68.94 6.1,68.9 6.1,68.91
  Top 0.3: R60.2 7.6,72.8 6,71.2 6,68.94 5.99,68.94 U$3.4
N$25
  Top 0.2: U1.2 82.85,86.85 TP0GOOD.1
N$26
  Top 0.2: R3.2 LED1.A
N$27
  Top 0.2: U7.18 32.19,33.59 32.7,34.1 34.1,34.1 37.3,37.3 TP46.1 37.3,40.7
N$28
  Top 0.2: U7.19 31.39,33.49 32.7,34.8 33.9,34.8 35.1,36 TP27.1
N$29
  Top 0.2: U3.14 82.35,72.45 82.6,72.1 86.8,72.1 87.1,72.4 R13.1 R9.2
N$30
  Top 0.2: RILIM2.1 85.6,73.6 85.36,73.84 U3.17
N$32
  Top 0.2: TP1GOOD.1 82.85,77.45 U3.2
N$33
  Top 0.2: U7.1 36,19 36.4,10 TP4.1
N$34
  Top 0.2: U7.58 28.19,8.54 TP47.1
N$35
  Top 0.2: U7.59 28.99,10.51 TP49.1
N$37
  Top 0.2: U7.60 29.79,10.91 30.9,9.8 32.4,9.8 TP48.1
N$38
  Top 0.2: U3.18 85.75,74.35 87.1,75.7 C8.1
N$39
  Top 0.2: U7.4 35.71,21.39 39.2,10.1 TP55.1
N$40
  Top 0.2: U7.5 35.81,22.19 40.5,10 42,10 TP54.1
N$41
  Top 0.2: U7.6 35.91,22.99 40.6,11.6 TP53.1
N$42
  Top 0.2: U7.7 35.91,23.79 40.5,14.6 TP52.1
N$43
  Top 0.2: U7.8 35.91,24.59 40.5,17.6 TP51.1
N$44
  Top 0.2: U7.9 36.01,25.39 40.5,20.6 TP50.1
N$45
  Top 0.2: LED2.A R10.2
N$46  (via drill 0.25)
  Top 0.2: v21.7,43.38 21.8,37 23.39,33.91 U7.29 | v29,43.42 v29,49 | v45.5,49 45.5,54.7 44.66,55.54 U8.7
  Bottom 0.2: v21.7,43.38 v29,43.42 | v29,49 v45.5,49
N$47  (via drill 0.25)
  Top 0.2: U7.30 22.59,33.89 v22.6,34.14 | v46.2,34.2 46.2,54.8 44.96,56.04 U8.8
  Bottom 0.2: v22.6,34.14 27.56,34.14 28.6,33.1 30.1,33.1 31.2,34.2 v46.2,34.2
N$48  (via drill 0.25)
  Top 0.2: v21.2,36.9 21.19,35.49 21.79,34.89 U7.31 | v51.7,36.8 v51.7,54.8 | v47.7,54.8 46.5,55.9 45.65,56.75 U8.9
  Bottom 0.2: v21.2,36.9 v51.7,36.8 | v51.7,54.8 v47.7,54.8
N$49
  Top 0.2: R11.2 92.2,78 92.35,77.85 Q2.1 R12.1
N$50
  Top 0.2: R4.2 92.2,87.5 92.35,87.35 Q1.1 R5.1
N$51
  Top 0.2: Q2.3 90.45,76.45 91.2,75.7 91.7,75.7 92.35,75.05 Q2.6 R8.2
N$52
  Top 0.2: LED3.A R21.2
N$53
  Top 0.2: LED12.A R75.2
N$54
  Top 0.2: 7.4,52.1 7.3,52.2 7.2,52.3
  Top 0.3: R74.1 7.4,52.1 7.31,52.1 | U$4.1 7.3,52.16 7.3,52.2
N$55  (via drill 0.25)
  Top 0.2: v18,51.2 16.9,48.9 Q11.3 | v49.7,51.2 49.7,11.7 52,9.4 R75.1
  Bottom 0.2: v49.7,51.2 v18,51.2
N$56
  Top 0.2: LED7.A R52.2
N$57
  Top 0.2: R71.2 LED11.A
N$58
  Top 0.2: 8.9,87.56 R54.1
  Top 0.3: R54.1 arc90 8.85,87.66 | 8.9,87.56 U$1.1
N$59
  Top 0.2: U4.2 82.85,67.75 TP2GOOD.1
N$60
  Top 0.2: R63.2 LED9.A
N$61  (via drill 0.25)
  Top 0.2: v17,71.9 Q9.3 | v56,71.9 v56,48.3 | v43.4,32.9 v43.4,48.3 | v46.2,32.9 46.2,9.3 46,9.1 R63.1
  Bottom 0.2: v56,71.9 47.2,71.9 45.3,70 39.3,70 37.4,71.9 v17,71.9 | v46.2,32.9 v43.4,32.9 | v43.4,48.3 v56,48.3
N$62
  Top 0.2: U4.18 85.85,64.85 87.1,66.1 C11.1
N$63
  Top 0.2: R23.1 Q4.1 92.35,68.15 92.2,68.3 R22.2
N$64
  Top 0.2: Q4.4 R20.1
N$65
  Top 0.2: Q4.3 90.45,66.75 91,66.2 91.8,66.2 92.35,65.65 Q4.6 R17.2
N$66
  Top 0.2: R28.2 LED4.A
N$67
  Top 0.2: U13.14 82.35,15.65 82.9,15.1 86.9,15.1 87.1,15.3 R69.1 R65.2
N$68
  Top 0.2: RILIM8.1 85.6,16.5 85.25,16.84 U13.17
N$69
  Top 0.2: U13.2 82.85,20.25 TP7GOOD.1
N$70
  Top 0.2: U13.18 85.75,17.35 87.1,18.7 C30.1
N$71
  Top 0.2: R68.1 Q10.1 92.35,20.85 92.2,21 R67.2
N$72
  Top 0.2: Q1.3 90.47,86.38 90.47,85.72 90.99,85.2 91.6,85.2 92.35,84.45 Q1.6 R1.2
N$73
  Top 0.2: Q10.3 90.45,19.15 90.9,18.7 91.9,18.7 92.35,18.25 Q10.6 R64.2
N$74
  Top 0.2: LED5.A R42.2
N$75
  Top 0.2: U9.14 82.35,34.45 82.8,34 86.9,34 87.1,34.2 R51.1 R47.2
N$76
  Top 0.2: RILIM6.1 85.6,35.5 85.25,35.84 U9.17
N$77
  Top 0.2: U9.2 82.85,39.25 TP5GOOD.1
N$78
  Top 0.2: U9.18 85.95,36.35 87.1,37.5 C24.1
N$79
  Top 0.2: R50.1 Q7.1 92.35,39.65 92.2,39.8 R49.2
N$80
  Top 0.2: Q1.4 R2.1
N$81
  Top 0.2: Q7.3 90.45,38.15 91,37.6 91.9,37.6 92.35,37.15 Q7.6 R46.2
N$82
  Top 0.2: LED6.A R48.2
N$83
  Top 0.2: U6.14 82.35,43.95 82.8,43.5 86.9,43.5 87.1,43.7 R45.1 R41.2
N$84
  Top 0.2: U6.17 85.16,45.34 85.6,44.9 RILIM5.1
N$85
  Top 0.2: U6.2 82.85,48.75 TP4GOOD.1
N$86
  Top 0.2: U6.18 85.85,45.85 87.1,47.1 C21.1
N$87
  Top 0.2: R44.1 Q6.1 92.35,49.35 92.2,49.5 R43.2
N$88
  Top 0.2: R27.1 Q5.4
N$89
  Top 0.2: R40.2 Q6.6 92.35,46.55 91.8,47.1 91,47.1 90.75,47.35 90.5,47.6 90.45,47.65 Q6.3
N$90
  Top 0.2: LED8.A R56.2
N$91
  Top 0.2: U5.14 82.35,53.55 83,53 86.7,53 87.1,53.3 R31.1 R27.2
N$92
  Top 0.2: RILIM4.1 85.6,54.5 85.25,54.84 U5.17
N$93
  Top 0.2: U5.2 82.85,58.35 TP3GOOD.1
N$94
  Top 0.2: U5.18 85.95,55.35 87.1,56.5 C16.1
N$95
  Top 0.2: R29.2 92.2,58.7 92.3,58.6 92.3,57.95 Q5.1 R30.1
N$96
  Top 0.2: R41.1 Q6.4
N$97
  Top 0.2: Q5.3 90.45,57.15 91,56.6 91.9,56.6 92.35,56.15 Q5.6 R26.2
N$98
  Top 0.2: LED10.A R66.2
N$99
  Top 0.2: U10.14 82.35,24.95 82.8,24.5 87,24.5 87.1,24.6 R59.1 R55.2
N$100
  Top 0.2: RILIM7.1 85.6,26 85.25,26.34 U10.17
N$101
  Top 0.2: U10.2 82.85,29.85 TP6GOOD.1
N$102
  Top 0.2: U10.18 85.75,26.85 87.1,28.2 87.1,29.4 87.2,29.5 C26.1
N$103
  Top 0.2: R58.1 Q8.1 92.35,30.35 92.2,30.5 R57.2
N$104
  Top 0.2: TP56.1 18.6,34.6 20.4,32.8 U7.32
N$105
  Top 0.2: Q8.3 90.45,28.55 90.9,28.1 92,28.1 92.35,27.75 Q8.6 R53.2
N$106
  Top 0.2: D3.2 C10.1 R18.1 26.5,79.35 Q3.1
N$107  (via drill 0.25)
  Top 0.2: v44.8,10.5 v44.8,52.5 | U7.61 30.59,11.11 31.2,10.5 v35,10.5 | U8.1 41.14,52.64 v41,52.5
  Bottom 0.2: v35,10.5 v44.8,10.5 | v44.8,52.5 v41,52.5
N$108
  Top 0.2: R47.1 Q7.4
N$109
  Top 0.2: R16.1 R15.1 | R15.1 R14.1 28.9,64.3 29.3,63.9 29.3,61.8 28.8,61.3 28.8,60.34 TP43.1 28.78,58.62 R19.1 | R15.1 26.5,66.4 26.6,66.5 26.58,66.5 D3.1
N$110
  Top 0.2: R65.1 Q10.4
N$111
  Top 0.2: R55.1 Q8.4
NUCLEAROPTION0  (via drill 0.25)
  Top 0.2: v24.9,45 R16.2 | v16.1,45 16.1,34.9 19.2,31.8 U7.33
  Bottom 0.2: v16.1,45 v24.9,45
NUCLEAROPTION1  (via drill 0.25)
  Top 0.2: v26.5,44.2 R15.2 | v15.4,44.2 15.4,33 18.2,30.2 U7.34
  Bottom 0.2: v15.4,44.2 v26.5,44.2
NUCLEAROPTION2  (via drill 0.25)
  Top 0.2: U7.43 20.99,22.99 22,23 22,29.7 16.8,34.9 v16.8,45.9 | R14.2 28.1,62.1 27.5,61.4 v27.5,45.9
  Bottom 0.2: v16.8,45.9 v27.5,45.9
NUCLEAROPTION_OUT  (via drill 0.25)
  Top 0.2: 33.24,90.76 TP44.1 CF1.P$16 CF1.P$15 | v27.8,89.1 27.8,88.6 27.5,88.3 Q3.3
  Bottom 0.2: v27.8,89.1 29.3,89.1 29.6,88.8 32,88.8 TP44.1
PB0
  Top 0.2: U7.10 36.01,26.19 40.5,23.6 TP7.1
PB1
  Top 0.2: U7.11 36.01,26.99 40.5,26.6 TP8.1
PB2
  Top 0.2: U7.12 36.09,27.79 40.6,29.5 TP9.1
PB3
  Top 0.2: U7.13 35.99,28.59 40.6,32.6 TP15.1
PB4
  Top 0.2: U7.14 35.99,29.39 40.6,34 42,34 TP16.1
PB5
  Top 0.2: U7.15 35.99,30.19 39.9,34.1 39.9,37.9 40.5,38.5 TP17.1
PB6
  Top 0.2: U7.16 34.7,31.08 36.08,31.08 39,34 39,38 40.8,39.7 40.8,40.5 TP18.1
PB7
  Top 0.2: U7.17 33.99,32.79 38.5,37.3 38.5,39.5 TP19.1
PCB3_EN  (via drill 0.25)
  Top 0.2: v32.9,59.6 v32.9,46.6 | v17.5,46.6 17.5,34.8 22.5,29.8 22.5,21.7 20.6,19.8 U7.47 18,19.8 12.5,8.5 TP11.1 | R29.1 v89.1,59.7
  Bottom 0.2: v89.1,59.7 v32.9,59.6 | v32.9,46.6 v17.5,46.6
RXD0  (via drill 0.25)
  Top 0.2: v47.6,47.6 v47.6,19.7 | U7.2 33.69,19.79 v33,19.8 | v11.4,47.6 11.4,48.1 11.3,48.2 | 11.3,48.2 11,48.5 R72.2 | Q11.1 12.95,49.85 11.3,48.2
  Bottom 0.2: v11.4,47.6 v47.6,47.6 | v33,19.8 v47.6,19.7
RXD1  (via drill 0.25)
  Top 0.2: v23.1,72.8 23.1,37 24.99,33.91 U7.27
  Top 0.3: Q9.1 13.4,72.85 v12.46,72.85 11.15,72.85 arc90 R60.1
  Bottom 0.2: v23.1,72.8 v12.46,72.85
TXD0  (via drill 0.25)
  Top 0.2: 4.69,63.6 v5.7,63.6 | v51.1,63.1 v51.1,22.4 51.1,11.4 53.7,8.8 53.7,3.3 53.2,2.8 50.8,2.7 50.5,3 LED11.K | U7.3 33.2,20.59 v33.2,22.4
  Top 0.3: U$2.2 4.69,63.55 4.69,63.6
  Bottom 0.2: v33.2,22.4 v51.1,22.4 | v5.7,63.6 6.2,63.1 v51.1,63.1
TXD1  (via drill 0.25)
  Top 0.2: v22.4,74.9 22.4,37 24.2,33.9 24.2,32.89 24.19,32.89 U7.28 v24.2,22.4 | v23.8,74.9 v23.8,86.3 | 4.7,87.6 v4.7,89.1 | v11.9,89 v11.9,86.3 | v4.2,22.4 4.2,12.6 10.5,6.3 17.8,6.3 22.2,1.9 31.4,1.9 33.25,3.75 LED7.K
  Top 0.3: U$1.2 4.7,87.6
  Bottom 0.2: v22.4,74.9 v23.8,74.9 | v23.8,86.3 v11.9,86.3 | v4.7,89.1 11.9,89.1 v11.9,89 | v24.2,22.4 v4.2,22.4
UART_FC_RX  (via drill 0.25)
  Top 0.2: CF1.P$23 CF1.P$24 28.16,90.96 22.4,87 v22.4,81.9
  Top 0.3: R62.1 TP30.1
  Bottom 0.2: v22.4,81.9 13.6,81.9 12.6,82.9 TP30.1
UART_FC_TX  (via drill 0.25)
  Top 0.2: CF1.P$25 CF1.P$26 26.89,90.99 21.7,87 v21.7,77 | v10.8,77 TP31.1
  Top 0.3: TP31.1 9.8,73.8 5.1,73.8 4.71,74.19 U$3.2
  Bottom 0.2: v21.7,77 v10.8,77
UART_FC_VCC  (via drill 0.25)
  Top 0.2: CF1.P$21 CF1.P$22 29.43,90.93 23.1,87 v23.1,80.9 | 9.1,80.83 TP29.1
  Top 0.3: C27.2 7.25,79 U$1.5 7.25,80.92 9.07,80.92
  Top 0.5: 7.25,79.05 C27.2 | TP29.1 9.07,80.92
  Bottom 0.2: v23.1,80.9 TP29.1
UART_LGR_RX  (via drill 0.25)
  Top 0.2: CF1.P$29 CF1.P$30 | TP33.1 R73.1 | v20.3,59.2 20.3,87.01 24.34,91.05 CF1.P$30
  Top 0.406: CF1.P$30
  Bottom 0.2: v20.3,59.2 TP33.1
UART_LGR_TX  (via drill 0.25)
  Top 0.2: CF1.P$31 CF1.P$32 23.1,91 19.6,87 v19.6,53.3 | 11,53.2 TP34.1 11,51.6
  Top 0.3: 11,51.6 9.7,50.3 5.2,50.3 4.71,50.78 U$4.2
  Bottom 0.2: v19.6,53.3 TP34.1
UART_LGR_VCC  (via drill 0.25)
  Top 0.2: CF1.P$27 CF1.P$28 | 25.6,92.9 25.6,91 21,87 v21,57 | TP32.1 7.28,57 7.28,56.92 | 7.2,56.2 7.2,56.8 7.2,56.84
  Top 0.3: 7.25,55.05 7.2,55.05 7.2,56.2 | 7.2,56.8 7.2,56.83 U$2.5 7.28,56.83 7.28,56.92
  Top 0.406: CF1.P$28 25.6,92.9
  Top 0.5: 7.25,55.05 C31.2
  Bottom 0.2: v21,57 TP32.1
V+  (via drill 0.25)
  Top 0.2: R7.1 v37.2,73.5
  Bottom 0.2: v37.2,73.5 38.6,74.9 v43.9,74.9
  pour Top (isolate 0.2, no thermals): 42.1,91.5 49,91.5 49,74.5 42.1,74.5
VBUS  (via drill 0.25)
  Top 0.2: R17.1 v93.2,63.2 | Q6.2 v91.4,49.5 | Q7.2 v91.4,40 | Q8.2 v91.4,30.5 | v91.4,87.4 Q1.2 | R1.1 v93.1,82.2 | v93.1,72.8 R8.1 | Q2.2 v91.4,78 | v91.4,68.4 Q4.2 | R26.1 v93.1,53.7 | v91.4,58.9 Q5.2 | v93,44.2 R40.1 | v93,34.7 R46.1 | v93,25.2 R53.1 | R64.1 v93,15.8 | v91.4,21 Q10.2
  other vias: 81.6,62.9 81.55,43.82 81.5,34.3 81.4,24.9 81.65,15.33 81.2,81.9 81.3,72.4 81.5,53.3 81.65,14.53 81.4,24.1 81.5,33.5 81.55,43.03 81.5,52.53 81.6,62.1 81.3,71.64 81.21,81.17 80.5,81.9 80.5,81.2 80.5,72.4 80.5,71.6 80.8,62.1 80.8,62.9 80.7,52.53 80.7,53.33 80.75,43.82 80.75,43.02 80.7,33.5 80.7,34.3 80.6,24.9 80.6,24.1 80.85,14.53 80.85,15.33
  pour Route15 (isolate 0.2, no thermals): 37.8,80 75,80 75,12.9 78,12.9 78,7 93.5,7 93.5,91 53.5,91 53.5,100 37.8,100
  pour Top (isolate 0.2, rank 3, no thermals): 37.9,99.4 49,99.4 49,91.9 37.9,91.9
  pour Top (rank 2, no thermals): 79.8,26.9 81.9,26.9 81.9,22.4 80.7,22.4 79.8,23.3
  pour Top (rank 2, no thermals): 79.8,36.4 81.9,36.4 81.9,31.8 80.6,31.8 79.8,32.6
  pour Top (rank 2, no thermals): 79.8,45.9 81.9,45.9 81.9,41.4 80.3,41.4 79.8,41.8
  pour Top (rank 2, no thermals): 79.8,55.39 81.9,55.4 81.9,51 80.2,51 79.8,51.4
  pour Top (rank 2, no thermals): 79.8,65.04 80.6,65.04 80.6,64.1 82,64.1 82,60.5 80.1,60.5 79.8,60.8
  pour Top (isolate 0.2, rank 2, no thermals): 79.8,74.44 81.9,74.4 81.9,70.1 80.1,70.1 79.8,70.4
  pour Top (rank 2, no thermals): 79.8,17.4 82,17.4 82,12.9 79.8,12.9
  pour Top (isolate 0.2, rank 2, no thermals): 79.8,84 79.8,79.7 81.9,79.7 81.9,84
VCB0  (via drill 0.25)
  Top 0.2: v53.2,86.8 53.2,22.08 57,18.28 R3.1
  Bottom 0.2: v80.2,86.8 v53.2,86.8
  pour Top (isolate 0.2, no thermals): 82.1,100 82.1,84.3 79.9,84.3 79.9,100
VCB0_!FLT  (via drill 0.25)
  Top 0.2: v30.8,85.4 v30.8,42.7 | v4.9,42.1 v4.9,18.5 | v9.1,18.5 R32.2 9.53,20.5 TP26.1 12.5,20.5 17.99,23.79 U7.42 | U1.20 84.65,84.85 84.9,85.1 v84.9,85.4
  Bottom 0.2: v84.9,85.4 v30.8,85.4 | v30.8,42.7 5.5,42.7 v4.9,42.1 | v4.9,18.5 v9.1,18.5
VCB0_EN  (via drill 0.25)
  Top 0.2: v11,16 TP14.1 12.49,17.49 12.5,17.5 18,22.19 U7.44 | v2.8,16 v2.8,88.4 | R4.1 v89.6,88.4
  Bottom 0.2: v2.8,88.4 v89.6,88.4 | v2.8,16 v11,16
VCB0_IMON  (via drill 0.25 pad 0.25)
  Top 0.2: v55.3,84.7 v55.3,64.81 | v41.64,64.83 41.64,57.57 41.65,57.56 U8.11 | U1.19 85.25,84.35 v85.6,84.7 RIMON1.1
  Bottom 0.2: v85.6,84.7 83.6,84.7 83.4,84.9 80.6,84.9 80.4,84.7 v55.3,84.7 | v55.3,64.81 v41.64,64.83
VCB1  (via drill 0.25)
  Top 0.2: v53.9,78 53.9,22.1 60,16 R10.1
  Bottom 0.2: v78.4,78 v53.9,78
  pour Top (isolate 0.2, no thermals): 79.5,100 79.5,78.9 82,76.4 82,74.8 79.3,74.8 77.3,76.8 77.3,100
VCB1_!FLT  (via drill 0.25)
  Top 0.2: v3.5,76.3 v3.5,24.7 | v9.1,24.7 R33.2 TP25.1 12.5,23.5 18,24.6 U7.41 | U3.20 84.65,75.35 84.9,75.6 v84.9,75.9
  Bottom 0.2: v84.9,75.9 42,75.9 40.9,77 38,77 37.2,76.2 30.5,76.2 29.9,76.8 28,76.8 27.5,76.3 v3.5,76.3 | v3.5,24.7 v9.1,24.7
VCB1_EN  (via drill 0.25)
  Top 0.2: v57.4,79 v57.4,27.3 | v52.5,27.3 v52.5,21.7 | TP13.1 12.5,14.5 17.99,21.39 U7.45 20.39,21.39 v21,21.7 | v89.5,79 R11.1
  Bottom 0.2: v89.5,79 v57.4,79 | v52.5,21.7 v21,21.7 | v52.5,27.3 v57.4,27.3
VCB1_IMON  (via drill 0.25)
  Top 0.2: v49.5,75.3 v49.5,69 | U3.19 85.25,74.85 v85.6,75.2 RIMON2.1 | U8.12 41.15,63.55 40.6,64.1 v40.6,69
  Bottom 0.2: v85.6,75.2 83.6,75.2 83.4,75.4 80.7,75.4 80.6,75.3 v49.5,75.3 | v49.5,69 v40.6,69
VCB2  (via drill 0.25)
  Top 0.2: v54.6,70 54.6,22.1 63,13.7 R21.1
  Bottom 0.2: v76.3,70 v54.6,70
  pour Top (isolate 0.2, no thermals): 75.7,100 75.7,73.2 82,66.9 82,65.3 78.5,65.3 73.4,70.4 73.4,100
VCB2_!FLT  (via drill 0.25)
  Top 0.2: v84.9,66.4 84.9,66 84.75,65.85 U4.20 | v32.2,66.4 v32.2,52 | v19.9,52 v19.9,36.7 | v8.3,36.7 8.3,28.8 9.1,28 R34.2 TP24.1 12.9,26.5 14.01,25.39 U7.40
  Bottom 0.2: v84.9,66.4 v32.2,66.4 | v32.2,52 v19.9,52 | v19.9,36.7 v8.3,36.7
VCB2_EN  (via drill 0.25)
  Top 0.2: v50.4,69.1 v50.4,41.4 | v5.6,41.4 5.6,12.4 6.5,11.5 TP12.1 12.5,11.5 18,20.6 U7.46 | R22.1 v89.6,69.2
  Bottom 0.2: v50.4,41.4 v5.6,41.4 | v89.6,69.2 v50.4,69.1
VCB2_IMON  (via drill 0.25)
  Top 0.2: U4.19 85.25,65.35 v85.6,65.7 RIMON3.1 | U8.13 40.44,63.56 39.9,64.1 v39.9,65.7
  Bottom 0.2: v85.6,65.7 83.6,65.7 83.3,66 80.8,66 80.5,65.7 v39.9,65.7
VCB3  (via drill 0.25)
  Top 0.2: v55.3,58.7 55.3,22.1 66,11.4 R28.1
  Bottom 0.2: v76.6,58.7 v55.3,58.7
  pour Top (isolate 0.2, rank 2, no thermals): 73.1,100 73.1,66.1 81.9,57.3 81.9,55.8 79,55.8 70.9,63.9 70.9,100
VCB3_!FLT  (via drill 0.25, 0.25 pad 0.25)
  Top 0.2: R35.2 TP23.1 12.6,29.5 15.91,26.19 U7.39 20.41,26.19 v21,25.6 | v49,25.6 v49,57 | U5.20 84.75,56.35 84.9,56.5 v84.9,56.9
  Bottom 0.2: v84.9,56.9 78.6,57 v49,57 | v49,25.6 v21,25.6
VCB3_IMON  (via drill 0.25)
  Top 0.2: U5.19 85.35,55.85 v85.6,56.2 RIMON4.1 | U8.10 42.15,57.25 42.4,57.5 46.8,57.5 v48.1,56.2
  Bottom 0.2: v48.1,56.2 80.5,56.2 80.7,56.4 83.4,56.4 83.6,56.2 v85.6,56.2
VCB4  (via drill 0.25)
  Top 0.2: v56,47.4 56,22.2 69.8,8.4 R42.1
  Bottom 0.2: v78.7,47.4 v56,47.4
  pour Top (isolate 0.2, no thermals): 69.4,100 69.4,60.3 81.9,47.8 81.9,46.3 77,46.3 67.1,56.2 67.1,100
VCB4_!FLT  (via drill 0.25, 0.25 pad 0.25)
  Top 0.2: R36.2 10.8,32.5 TP22.1 12.2,32.5 17.71,26.99 U7.38 v21.4,27 | v32.2,49.7 v32.2,43.4 | v45.5,30.3 v45.5,43.4 | v25.2,30.3 v25.2,27 | U6.20 84.75,46.85 84.9,47 v84.9,47.4
  Bottom 0.2: v84.9,47.4 81.6,47.4 79.3,49.7 v32.2,49.7 | v45.5,43.4 v32.2,43.4 | v21.4,27 v25.2,27 | v45.5,30.3 v25.2,30.3
VCB4_EN  (via drill 0.25)
  Top 0.2: TP10.1 14,9.9 18.1,19 U7.48 19.19,18.09 19,17.9 v16.9,13.5 | v23.8,50.4 v23.8,42 | v6.3,42 v6.3,13.5 | R43.1 v89.7,50.4
  Bottom 0.2: v89.7,50.4 v23.8,50.4 | v23.8,42 v6.3,42 | v6.3,13.5 v16.9,13.5
VCB4_IMON  (via drill 0.25)
  Top 0.2: U6.19 85.35,46.35 v85.6,46.7 RIMON5.1 | U8.15 39.94,55.04 38.8,53.9 v38.8,46.7
  Bottom 0.2: v38.8,46.7 80.5,46.7 80.7,46.9 83.3,46.9 83.5,46.7 v85.6,46.7
VCB5  (via drill 0.25)
  Top 0.2: v56.7,36.3 56.7,22.1 66.9,11.9 71.3,11.9 74,9.2 R48.1 | v78.4,36.3 78.4,38.6
  Bottom 0.2: v78.4,36.3 v56.7,36.3
  pour Top (isolate 0.2, rank 2, no thermals): 66.8,100 66.8,53.5 81.9,38.4 81.9,36.8 77.4,36.8 64.6,49.6 64.6,100
VCB5_!FLT  (via drill 0.25, 0.25 pad 0.25)
  Top 0.2: R37.2 TP21.1 11.8,35.5 13.6,33.7 13.6,32.5 18.3,27.8 U7.37 | v52.5,28.2 v52.5,38 | v20.7,27.8 U7.37 | U7.37 | U9.20 84.65,37.35 84.9,37.6 v84.9,38
  Bottom 0.2: v52.5,38 v84.9,38 | v52.5,28.2 20.89,28.19 v20.7,27.8
VCB5_EN  (via drill 0.25)
  Top 0.2: U7.49 20.13,17.19 v18.1,12.6 17,9.9 TP6.1 | v46.9,12.6 v46.9,40.8 | v89.5,40.8 R49.1
  Bottom 0.2: v46.9,40.8 v89.5,40.8 | v18.1,12.6 v46.9,12.6
VCB5_IMON  (via drill 0.25)
  Top 0.2: v56.8,37.2 v56.8,51.8 | 42.3,51.8 v42.3,51.9 42.3,53 42.15,53.15 U8.3 | U9.19 85.35,36.85 85.6,37.1 v85.6,37.2 RIMON6.1
  Bottom 0.2: v56.8,37.2 v85.6,37.2 | v56.8,51.8 v42.3,51.9
VCB6  (via drill 0.25)
  Top 0.2: v78.3,26.8 78.3,27.5 78.2,27.6 | R56.1 77,12.7 v62.9,26.8
  Bottom 0.2: v78.3,26.8 v62.9,26.8
  pour Top (isolate 0.2, no thermals): 63,100 63,47.8 81.9,28.9 81.9,27.3 76.8,27.3 60.8,43.3 60.8,100
VCB6_!FLT  (via drill 0.25)
  Top 0.2: v84.9,28.3 84.6,27.85 U10.20 | v50.4,29.4 v50.4,37.6 | v9.1,37.5 R38.2 TP20.1 12,38.5 14.3,36.2 14.3,32.5 18.21,28.59 U7.36
  Bottom 0.2: v84.9,28.3 54.7,28.3 53.6,29.4 v50.4,29.4 | v9.1,37.5 v50.4,37.6
VCB6_EN  (via drill 0.25)
  Top 0.2: R57.1 v89.6,31.5 | v45.5,29.1 v45.5,13.3 | TP3.1 v20,13.3 20,14.7 21.79,16.49 U7.50
  Bottom 0.2: v89.6,31.5 47.9,31.5 v45.5,29.1 | v45.5,13.3 v20,13.3
VCB6_IMON  (via drill 0.25)
  Top 0.2: v44.1,44.1 v44.1,26.6 | U10.19 85.45,27.35 v85.6,27.7 RIMON7.1 | U8.16 40.44,53.04 40.3,52.9 v40.3,44.1
  Bottom 0.2: v40.3,44.1 v44.1,44.1 | v44.1,26.6 58.8,26.6 60.1,27.9 83.9,27.9 84.1,27.7 v85.6,27.7
VCB7
  Top 0.2: R66.1 80,10.9 79,11.9 79,18
  pour Top (isolate 0.2, rank 2, no thermals): 60.5,100 60.5,40.8 81.9,19.4 81.9,17.8 76.6,17.8 58.1,36.3 58.1,100
VCB7_!FLT  (via drill 0.25)
  Top 0.2: v20.9,29.4 U7.35 18.21,29.39 14.9,32.7 14.9,38 12.3,40.6 11.06,40.6 TP45.1 10,40.6 9.7,41.4 R39.2 | v23.1,29.4 v23.1,31 | v43.4,18.2 v43.4,31 | v84.9,18.7 84.65,18.35 U13.20
  Bottom 0.2: v20.9,29.4 v23.1,29.4 | v43.4,31 30.7,31 30.5,30.8 29.1,30.8 28.9,31 v23.1,31 | v84.9,18.7 53.1,18.7 52.9,18.5 43.7,18.5 v43.4,18.2
VCB7_EN  (via drill 0.25)
  Top 0.2: v22.59,18.9 U7.51 22.59,16.39 20.9,14.7 20.9,12.2 23.1,10 23.1,8.6 TP2.1 | v89.5,22 R67.1
  Bottom 0.2: v89.5,22 55.7,22 52.6,18.9 32.8,18.9 32.4,19.3 23,19.3 v22.6,18.9 v22.59,18.9
VCB7_IMON  (via drill 0.25)
  Top 0.2: v48.3,17.8 v48.3,44.8 | U13.19 85.35,17.85 v85.6,18.1 RIMON8.1 | U8.2 41.65,45.25 v41.7,44.9
  Bottom 0.2: v85.6,18.1 83.6,18.1 83.4,18.3 53.3,18.3 53.1,18.1 48.6,18.1 v48.3,17.8 | v41.7,44.9 v48.3,44.8
VSOL
  Top 0.406: 35.8,93.2 36,93.4
  pour Top (isolate 0.2, rank 2, no thermals): 34,99 37.5,99 37.5,85.3 34,85.3

## Text on the board
tPlace: Portland State Aerospace Society / Oresat System Controller v1.1 / 2016/05/14 / James Heath, Will Harrington, Shan O'Dean, Michael Mathis / 2016 Capstone | 3V | UART1 | UART0 | 0 | 1 | 2 | 3 | 4 | 5 | 6 | 7